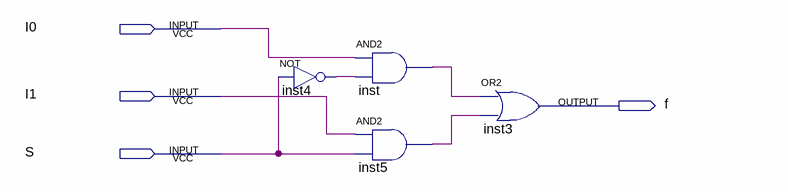
[diagram p0: schematic sheet]
// Quartus schematic Mux2_1.bdf as structural Verilog: 4 symbols, 4 pins
module Mux2_1 (
  input  I0,
  input  I1,
  input  S,
  output f
);

  wire inst4_out, inst5_out, inst_out;

  not inst4 (inst4_out, S);
  and inst (inst_out, I0, inst4_out);
  and inst5 (inst5_out, I1, S);
  or inst3 (f, inst_out, inst5_out);
endmodule
